# EAGLE design sliderController_V1.1 (EAGLE 7.3.0)
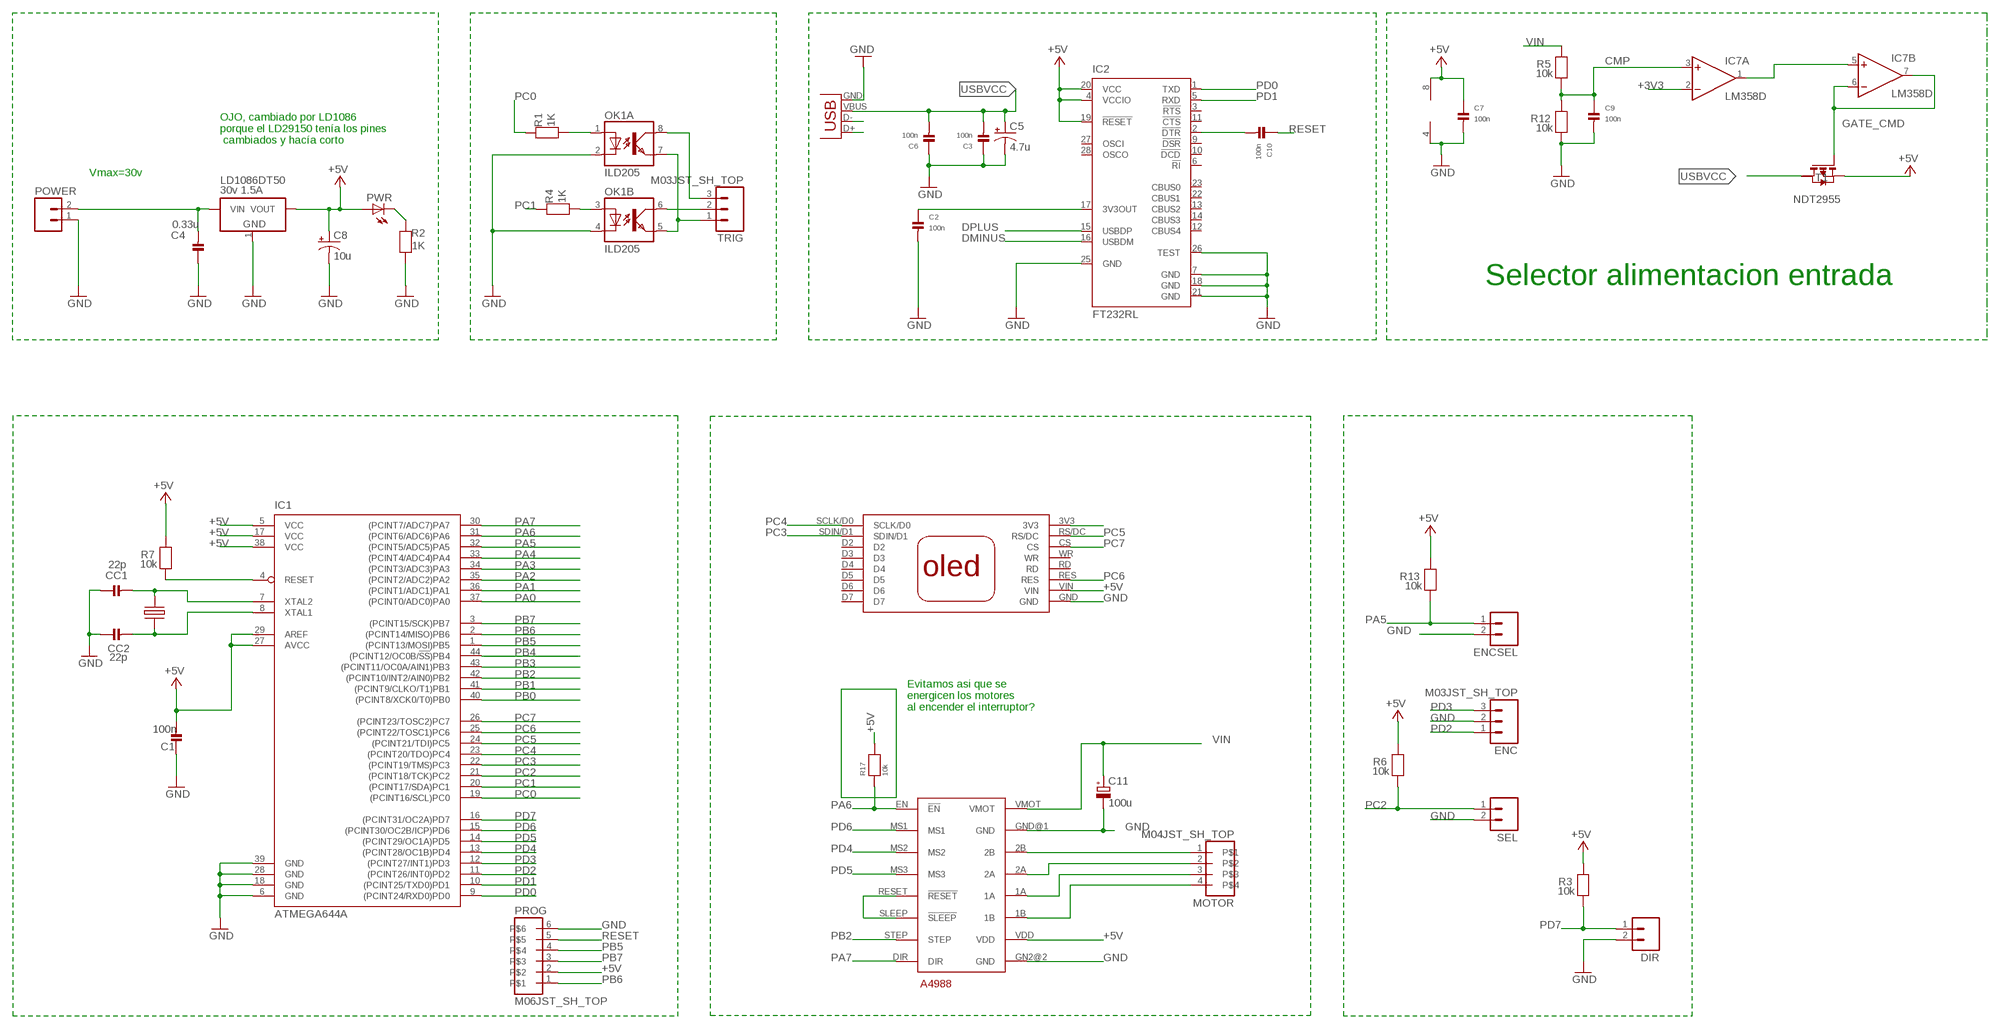
[diagram p0: schematic, sheet 1]

## Parts
A4988  STEPSTICK_A4988A4988  [STEPSTICK_A4988]
C1  100n  CAP_CERAMIC_0805  [_0805]
C2  100n  CAP_CERAMIC_0805  [_0805]
C3  100n  CAP_CERAMIC_0805  [_0805]
C4  0.33u  CAP_CERAMIC_0805  [_0805]
C5  4.7u  CAP_POL1206  [EIA3216]
C6  100n  CAP_CERAMIC_0805  [_0805]
C7  100n  CAP_CERAMIC0805  [0805]
C8  10u  CAP_POL1206  [EIA3216]
C9  100n  CAP_CERAMIC0805  [0805]
C10  100n  CAP_CERAMIC_0805  [_0805]
C11  100u  CPOL-EUD  [PANASONIC_D]
CC1  22p  CAP_CERAMIC_0805  [_0805]
CC2  22p  CAP_CERAMIC_0805  [_0805]
CRISTAL  CRISTALSMD  [CRISTAL5X3.2MM]
DIR  M02JST_SH_TOP  [JST_1.0_2_TOP]
ENC  M03JST_SH_TOP  [JST_1.0_3_TOP]
ENCSEL  M02JST_SH_TOP  [JST_1.0_2_TOP]
IC1  ATMEGA644A  [TQFP44]
IC2  FT232RL  [SSOP28]
IC7  LM358D  [SO08]
LD1086DT50  30v 1.5A  VREG_3PINS-DPAK  [DPAK]
MOTOR  M04JST_SH_TOP  [JST_1.0_4_TOP]
OK1  ILD205  [SOIC08]
POWER  M02JST_SH_TOP  [JST_1.0_2_TOP]
PROG  M06JST_SH_TOP  [JST_1.0_6_TOP]
PWR  LEDCHIP-LED0805  [CHIP-LED0805]
R1  1K  RESISTOR0805  [0805]
R2  1K  RESISTOR0805  [0805]
R3  10k  RESISTOR0805  [0805]
R4  1K  RESISTOR0805  [0805]
R5  10k  RESISTOR0805  [0805]
R6  10k  RESISTOR0805  [0805]
R7  10k  RESISTOR0805  [0805]
R12  10k  RESISTOR0805  [0805]
R13  10k  RESISTOR0805  [0805]
R17  10k  RESISTOR0805  [0805]
SEL  M02JST_SH_TOP  [JST_1.0_2_TOP]
T1  NDT2955  PMOSSOT223  [SOT223]
TRIG  M03JST_SH_TOP  [JST_1.0_3_TOP]
U$3  OLEDOLED1.3"  [OLED1.3"]
X2  USBSMD  [USB-MINIB]

## Nets
+3V3 [power]: C2.1 IC2.17(3V3OUT) IC7.2(A:-IN)
+5V: A4988.VDD C1.2 C7.1 C8.A(+) IC1.5(VCC) IC1.17(VCC) IC1.27(AVCC) IC1.29(AREF) IC1.38(VCC) IC2.4(VCCIO) IC2.19(!RESET) IC2.20(VCC) IC7.8(P:V+) LD1086DT50.2(VOUT) PROG.2 PWR.A R3.2 R6.2 R7.2 R13.2 R17.2 T1.3(S) U$3.VIN
CMP: C9.1 IC7.3(A:+IN) R5.1 R12.2
DMINUS: IC2.16(USBDM) X2.D-
DPLUS: IC2.15(USBDP) X2.D+
GATE_CMD: IC7.6(B:-IN) IC7.7(B:OUT) T1.1(G)
GND [gnd]: A4988.GN2@2(GND) A4988.GND@1(GND) C1.1 C2.2 C3.1 C4.1 C5.C(-) C6.1 C7.2 C8.C(-) C9.2 C11.- CC1.1 CC2.1 DIR.2 ENC.2 ENCSEL.2 IC1.6(GND) IC1.18(GND) IC1.28(GND) IC1.39(GND) IC2.7(GND) IC2.18(GND) IC2.21(GND) IC2.25(GND) IC2.26(TEST) IC7.4(P:V-) LD1086DT50.1(GND) OK1.2(A:C) OK1.4(B:C) POWER.1 PROG.6 R2.2 R12.1 SEL.2 U$3.GND X2.GND
N$1: C10.2 IC2.2(!DTR)
N$2: PWR.C R2.1
N$3: CC1.2 CRISTAL.B IC1.7(XTAL2)
N$4: A4988.RESET(!RESET) A4988.SLEEP(!SLEEP)
N$6: OK1.1(A:A) R1.2
N$7: OK1.8(A:COL) TRIG.3
N$9: OK1.6(B:COL) TRIG.2
N$10: OK1.5(B:EMIT) OK1.7(A:EMIT) TRIG.1
N$11 [usbvcc]: A4988.2B MOTOR.1
N$13: CC2.2 CRISTAL.A IC1.8(XTAL1)
N$14: OK1.3(B:A) R4.2
N$16 [usbvcc]: A4988.2A MOTOR.2
N$18 [usbvcc]: A4988.1A MOTOR.3
N$23 [usbvcc]: A4988.1B MOTOR.4
N$24: U$3.3V3
N$28: IC7.1(A:OUT) IC7.5(B:+IN)
PA0: IC1.37((PCINT0/ADC0)PA0)
PA1: IC1.36((PCINT1/ADC1)PA1)
PA2: IC1.35((PCINT2/ADC2)PA2)
PA3: IC1.34((PCINT3/ADC3)PA3)
PA4: IC1.33((PCINT4/ADC4)PA4)
PA5: ENCSEL.1 IC1.32((PCINT5/ADC5)PA5) R13.1
PA6: A4988.EN(!EN) IC1.31((PCINT6/ADC6)PA6) R17.1
PA7: A4988.DIR IC1.30((PCINT7/ADC7)PA7)
PB0: IC1.40((PCINT8/XCK0/T0)PB0)
PB1: IC1.41((PCINT9/CLKO/T1)PB1)
PB2: A4988.STEP IC1.42((PCINT10/INT2/AIN0)PB2)
PB3: IC1.43((PCINT11/OC0A/AIN1)PB3)
PB4: IC1.44((PCINT12/OC0B/!SS!)PB4)
PB5: IC1.1((PCINT13/MOSI)PB5) PROG.4
PB6: IC1.2((PCINT14/MISO)PB6) PROG.1
PB7: IC1.3((PCINT15/SCK)PB7) PROG.3
PC0: IC1.19((PCINT16/SCL)PC0) R1.1
PC1: IC1.20((PCINT17/SDA)PC1) R4.1
PC2: IC1.21((PCINT18/TCK)PC2) R6.1 SEL.1
PC3: IC1.22((PCINT19/TMS)PC3) U$3.SDIN/D1
PC4: IC1.23((PCINT20/TDO)PC4) U$3.SCLK/D0
PC5: IC1.24((PCINT21/TDI)PC5) U$3.RS/DC
PC6: IC1.25((PCINT22/TOSC1)PC6) U$3.RES
PC7: IC1.26((PCINT23/TOSC2)PC7) U$3.CS
PD0: IC1.9((PCINT24/RXD0)PD0) IC2.1(TXD)
PD1: IC1.10((PCINT25/TXD0)PD1) IC2.5(RXD)
PD2: ENC.1 IC1.11((PCINT26/INT0)PD2)
PD3: ENC.3 IC1.12((PCINT27/INT1)PD3)
PD4: A4988.MS2 IC1.13((PCINT28/OC1B)PD4)
PD5: A4988.MS3 IC1.14((PCINT29/OC1A)PD5)
PD6: A4988.MS1 IC1.15((PCINT30/OC2B/ICP)PD6)
PD7: DIR.1 IC1.16((PCINT31/OC2A)PD7) R3.1
RESET: C10.1 IC1.4(RESET) PROG.5 R7.1
USBVCC: C3.2 C5.A(+) C6.2 T1.2(D) X2.VBUS
VIN [power]: A4988.VMOT C4.2 C11.+ LD1086DT50.3(VIN) POWER.2 R5.2
Unconnected: IC2.3(!RTS) IC2.6(!RI) IC2.9(!DSR) IC2.10(!DCD) IC2.11(!CTS) IC2.12(CBUS4) IC2.13(CBUS2) IC2.14(CBUS3) IC2.22(CBUS1) IC2.23(CBUS0) IC2.27(OSCI) IC2.28(OSCO) T1.4(D2) U$3.D2 U$3.D3 U$3.D4 U$3.D5 U$3.D6 U$3.D7 U$3.RD U$3.WR

## Notes on the sheet
- OJO, cambiado por LD1086 
  porque el LD29150 tenía los pines
   cambiados y hacía corto
- Vmax=30v
- Selector alimentacion entrada
- Evitamos asi que se 
  energicen los motores 
  al encender el interruptor?

## Library data of the parts
A4988 = javimontero:STEPSTICK_A4988: Pololu A4988 stepstick stepper driver
C1-C4 C6 C7 C9 C10 CC1 CC2 = microbuilder:CAP_CERAMIC: Ceramic Capacitors 0402 - 0402 Surface Mount Capacitors 16pF 50V 5% [Digikey: 445-4899-2-ND] 18pF 50V 5% [Digikey: 490-1281-2-ND] 22pF 50V 5% [Digikey: 490-1283-2-ND] 68pF 50V 5% [Digikey: 490-1289-2-ND] 0.1uF 10V 10% [Digikey: 490-1318-2-ND] 1.0uF 6.3V 10% [Digikey: 490-1320-2-ND] 0603 - 0603 Surface Mount Capacitors 16 pF 50V 5% [Digikey: 445-5051-2-ND] 22 pF 50V [Digikey: PCC220ACVTR-ND] 33 pF 50V 5% [Digikey: 490-1415-1-ND] 56pF 50V 5% [Digikey: 490-1421-1-ND] 220pF 50V 5% [Digikey: 445-1285-1-ND] 680 pF 50V 2200 pF 50V 5% C0G [Digikey: 445-1297-1-ND] 5600 pF 100V 5% X7R [Digikey: 478-3711-1-ND] 0.1 µF 25V 10% [Digikey: PCC2277TR-ND] 0.22 µF 16V 10% X7R [Digikey: 445-1318-1-ND] 1.0 µF 25V 10% [Digikey: 445-5146-2-ND] 0603 - RF Specific 3pF 250V +/-0.1pF RF [Digikey: 712-1347-1-ND] 18 pF 250V 5% [Digikey: 478-3505-1-ND or 712-1322-1-ND] 56 pF 250V 5% C0G RF [Digikey: 490-4867-1-ND] 68 pF 250V RF [Digikey: 490-4868-1-ND] 0805 - 0805 Surface Mount Capacitors 220 pF 250V 2% RF Ceramic Capacitor [Digikey: 712-1398-1-ND] 1000 pF 50V 2% NP0 Ceramic Capacitor [Digikey: 478-3760-1-ND] 0.1 µF 25V 10% Ceramic Capacitor [Digikey: PCC1828TR-ND] 1.0 µF 16V 10% Ceramic Capacitor[Digikey: 490-1691-2-ND] 10.0 µF 10V 10% Ceramic Capacitor[Digikey: 709-1228-1-ND] 10.0 uF 16V 10% Ceramic Capacitor [Digikey: 478-5165-2-ND] 47 uF 6.3V 20% Ceramic Capacitor [Digikey: 587-1779-1-ND or 399-5506-1-ND] 1206 - 1206 Surface Mount Capacitors 47uF 10V 20% Ceramic Capacitor [Digikey: 490-5528-1-ND or 399-5508-1-ND or 445-6010-1-ND] 100uF 6.3V -20%, +80% Y5V Ceramic Capacitor (Digikey: 490-4512-1-ND, Mouser: 81-GRM31CF50J107ZE1L)
C5 C8 = SparkFun-Passives:CAP_POL: Capacitor Polarized These are standard SMD and PTH capacitors. Normally 10uF, 47uF, and 100uF in electrolytic and tantalum varieties. Always verify the external diameter of the through hole cap, it varies with capacity, voltage, and manufacturer. The EIA devices should be standard.
C11 = matt rcl:CPOL-EU: POLARIZED CAPACITOR, European symbol
CRISTAL = javimontero:CRISTALSMD
DIR ENCSEL POWER SEL = javimontero:M02: Terminal block Contacts: 2 PITCH2.54: 2.54mm pitch Mouser: 571-282834-2 <http://es.mouser.com/Search/ProductDetail.aspx?R=282834-2virtualkey57110000virtualkey571-282834-2> PITCH5.00: 5mm pitch
ENC TRIG = javimontero:M03
IC1 = atmel:ATMEGA644: 8-bit Microcontroller with 64K Bytes In-System Programmable Flash Source: http://www.atmel.com/dyn/resources/prod_documents/doc2593.pdf; MPN: ATMEGA644PV-10AU; OC_FARNELL: 1455123; OC_NEWARK: 58M3748
IC2 = ftdichip:FT232R: Source: http://www.ftdichip.com/Documents/DataSheets/DS_FT232R_v104.pdf; MPN: FT232RL; OC_FARNELL: 1146032; OC_NEWARK: 91K9918
IC7 = linear:LM358: OP AMP also LM158; LM258; LM2904 Source: http://cache.national.com/ds/LM/LM158.pdf
LD1086DT50 = dp_devices:VREG_3PINS: Various 3 pin voltage regulators in different packages Double check the right pinout for the right part
MOTOR = javimontero:M04
OK1 = optocoupler:ILD2*: Siemens ILD205/206/207/211/213/217 DUAL PHOTOTRANSISTOR SMALL OUTLINE SURFACE MOUNT OPTOCOUPLER Source: 153385-da-01-en-Optocoupler_ILD205-T.pdf; MF: VISHAY/TELEFUNKEN; MPN: ILD205T; OC_FARNELL: 1469512; OC_NEWARK: 20H8678
PROG = javimontero:M06
PWR = led:LED: LED OSRAM: - CHIPLED LG R971, LG N971, LY N971, LG Q971, LY Q971, LO R971, LY R971 LH N974, LH R974 LS Q976, LO Q976, LY Q976 LO Q996 - Hyper CHIPLED LW Q18S LB Q993, LB Q99A, LB R99A - SideLED LS A670, LO A670, LY A670, LG A670, LP A670 LB A673, LV A673, LT A673, LW A673 LH A674 LY A675 LS A676, LA A676, LO A676, LY A676, LW A676 LS A679, LY A679, LG A679 - Hyper Micro SIDELED® LS Y876, LA Y876, LO Y876, LY Y876 LT Y87S - SmartLED LW L88C, LW L88S LB L89C, LB L89S, LG L890 LS L89K, LO L89K, LY L89K LS L896, LA L896, LO L896, LY L896 - TOPLED LS T670, LO T670, LY T670, LG T670, LP T670 LSG T670, LSP T670, LSY T670, LOP T670, LYG T670 LG T671, LOG T671, LSG T671 LB T673, LV T673, LT T673, LW T673 LH T674 LS T676, LA T676, LO T676, LY T676, LB T676, LH T676, LSB T676, LW T676 LB T67C, LV T67C, LT T67C, LS T67K, LO T67K, LY T67K, LW E67C LS E67B, LA E67B, LO E67B, LY E67B, LB E67C, LV E67C, LT E67C LW T67C LS T679, LY T679, LG T679 LS T770, LO T770, LY T770, LG T770, LP T770 LB T773, LV T773, LT T773, LW T773 LH T774 LS E675, LA E675, LY E675, LS T675 LS T776, LA T776, LO T776, LY T776, LB T776 LHGB T686 LT T68C, LB T68C - Hyper Mini TOPLED® LB M676 - Mini TOPLED Santana® LG M470 LS M47K, LO M47K, LY M47K Source: http://www.osram.convergy.de LUXEON: - LUMILED® LXK2-PW12-R00, LXK2-PW12-S00, LXK2-PW14-U00, LXK2-PW14-V00 LXK2-PM12-R00, LXK2-PM12-S00, LXK2-PM14-U00 LXK2-PE12-Q00, LXK2-PE12-R00, LXK2-PE12-S00, LXK2-PE14-T00, LXK2-PE14-U00 LXK2-PB12-K00, LXK2-PB12-L00, LXK2-PB12-M00, LXK2-PB14-N00, LXK2-PB14-P00, LXK2-PB14-Q00 LXK2-PR12-L00, LXK2-PR12-M00, LXK2-PR14-Q00, LXK2-PR14-R00 LXK2-PD12-Q00, LXK2-PD12-R00, LXK2-PD12-S00 LXK2-PH12-R00, LXK2-PH12-S00 LXK2-PL12-P00, LXK2-PL12-Q00, LXK2-PL12-R00 Source: www.luxeon.com KINGBRIGHT: KA-3528ASYC Source: www.kingbright.com
R1-R7 R12 R13 R17 = microbuilder:RESISTOR: Resistors 0402 - 0402 Surface Mount Package 22 Ohm 1% 1/16W [Digikey: 311-22.0LRTR-ND] 33 Ohm 5% 1/16W 1.0K 5% 1/16W 1.5K 5% 1/16W 2.0K 1% 1/16W 10.0K 1% 1/16W [Digikey: 311-10.0KLRTR-ND] 10.0K 5% 1/16W [Digikey: RMCF0402JT10K0TR-ND] 12.1K 1% 1/16W [Digikey: 311-22.0LRTR-ND] 100.0K 5% 1/16W 0603 - 0603 Surface Mount Package 0 Ohm 1/10 Watt 1% Resistor 15 Ohm 1/10 Watt 1% Resistor 33 Ohm 1/10 Watt 1% Resistor 49.9 Ohm 1/10 Watt 1% Resistor 100 Ohm 1/10 Watt 1% Resistor 150 Ohm 1/10 Watt 1% Resistor 240 Ohm 1/10 Watt 1% Resistor 390 Ohm 1/10 Watt 1% Resistor 560 Ohm 1/10 Watt 1% Resistor 680 Ohm 1/10 Watt 1% Resistor 750 Ohm 1/10 Watt 1% Resistor 1.0K Ohm 1/10 Watt 1% Resistor 1.5K Ohm 1/10 Watt 1% Resistor 2.0K Ohm 1/10 Watt 1% Resistor 2.2K Ohm 1/10 Watt 1% Resistor 3.3K Ohm 1/10 Watt 1% Resistor 4.7K Ohm 1/10 Watt 1% Resistor 10.0K Ohm 1/10 Watt 1% Resistor 12.0K Ohm 1/10 Watt 1% Resistor 12.1K Ohm 1/10 Watt 1% Resistor 20.0K Ohm 1/10 Watt 1% Resistor 33.0K Ohm 1/10 Watt 1% Resistor 100.0K Ohm 1/10 Watt 1% Resistor 0805 - 0805 Surface Mount Package 0 Ohm 1/8 Watt 1% Resistor 33 Ohm 1/8 Watt 1% Resistor 100 Ohm 1/8 Watt 1% Resistor 150 Ohm 1/8 Watt 1% Resistor 200 Ohm 1/8 Watt 1% Resistor 240 Ohm 1/8 Watt 1% Resistor 330 Ohm 1/8 Watt 1% Resistor 390 Ohm 1/8 Watt 1% Resistor 470 Ohm 1/8 Watt 1% Resistor 1.0K Ohm 1/8 Watt 1% Resistor 1.5K Ohm 1/8 Watt 1% Resistor 2.0K Ohm 1/8 Watt 1% Resistor 4.7K Ohm 1/8 Watt 1% Resistor 5.1K Ohm 1/8 Watt 1% Resistor 5.6K Ohm 1/8 Watt 1% Resistor 10.0K Ohm 1/8 Watt 1% Resistor 22.0K Ohm 1/8 Watt 1% Resistor 33.0K Ohm 1/8 Watt 1% Resistor 100K Ohm 1/8 Watt 1% Resistor 1206 - 1206 Surface Mount Package 2012 - 2010 Surface Mount Package 0.11 Ohm 1/2 Watt 1% Resistor - Digikey: RHM.11UCT-ND
T1 = zetex:PMOSSOT223: MOS FET
U$3 = javimontero:OLED: Display OLED
X2 = SparkFun-Connectors:USB: USB Connectors USB-B-PTH is fully proven SKU : PRT-00139 USB-miniB is fully proven SKU : PRT-00587 USB-A-PCB is untested. USB-A-H is throughly reviewed, but untested. Spark Fun Electronics SKU : PRT-00437 USB-B-SMT is throughly reviewed, but untested. Needs silkscreen touching up. USB-A-S has not been used/tested USB-MB-H has not been used/tested

## Net classes
0 default: width 0.203 mm, drill 0.305 mm, clearance 0.203 mm
1 power: width 0.406 mm, drill 0.711 mm, clearance 0.203 mm
2 gnd: width 0.203 mm, drill 0.305 mm, clearance 0.203 mm
3 usbvcc: width 0.203 mm, drill 0.305 mm, clearance 0.203 mm
4 power5: width 0.203 mm, drill 0.305 mm, clearance 0.203 mm

## Board
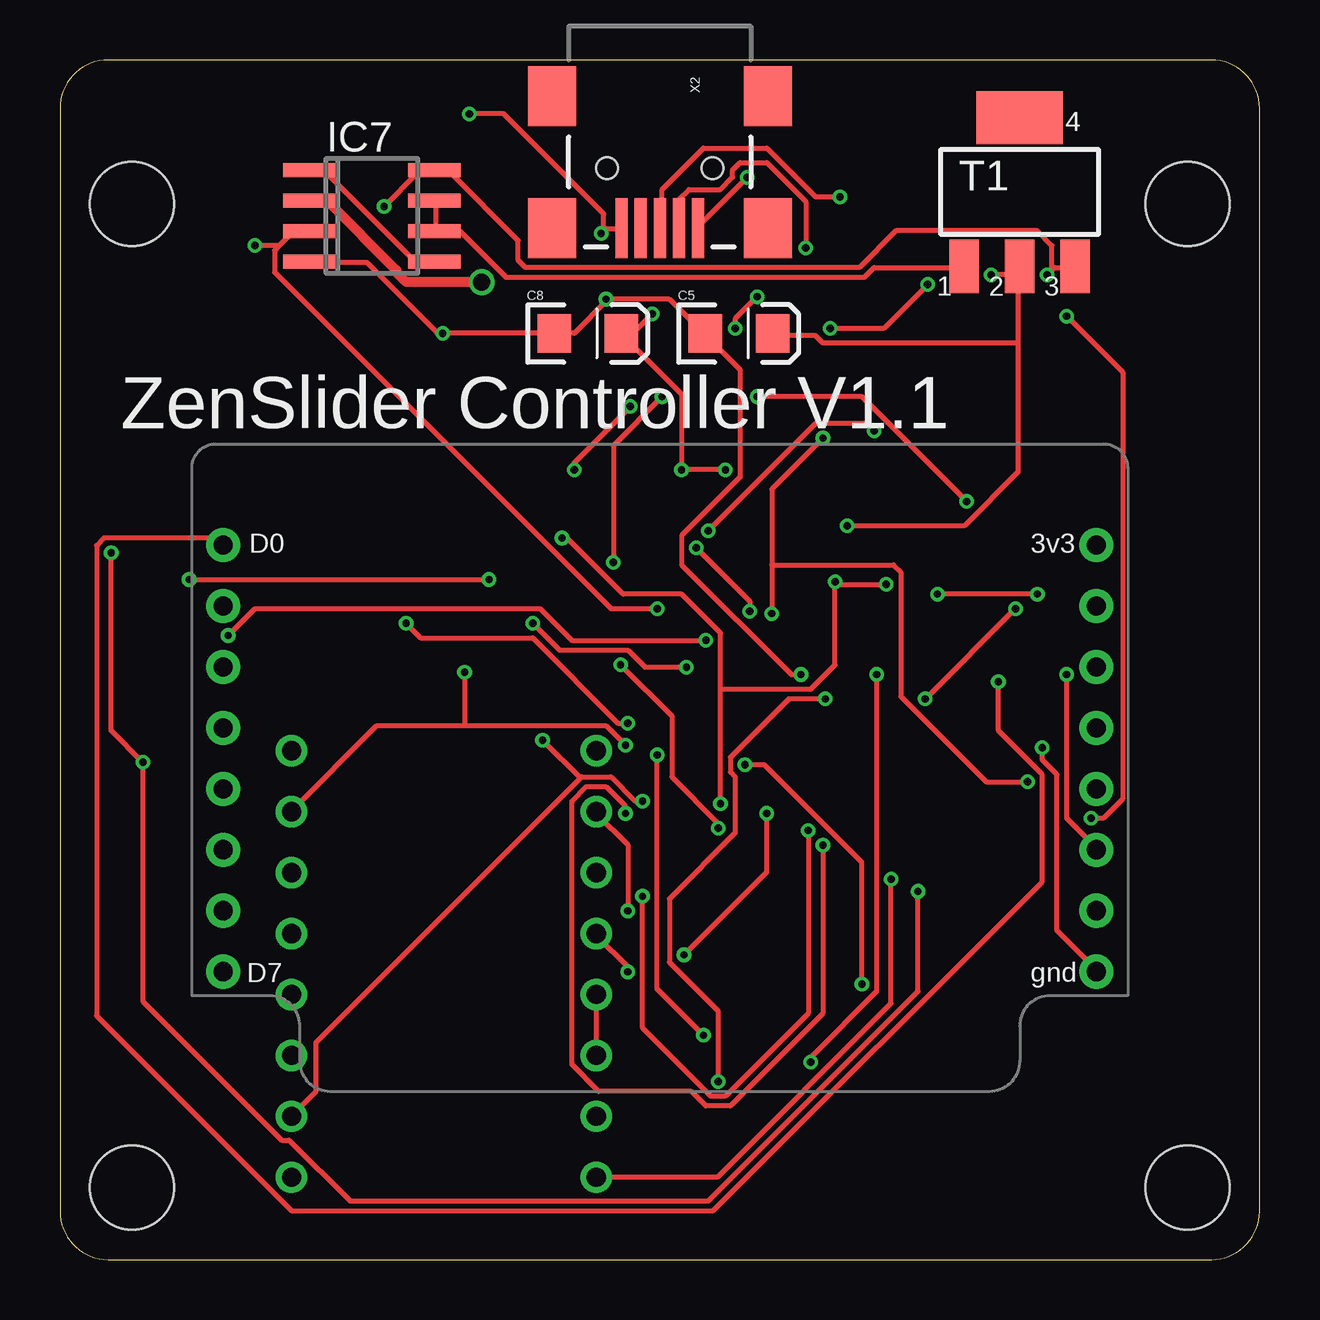
[diagram p1: board, top side]
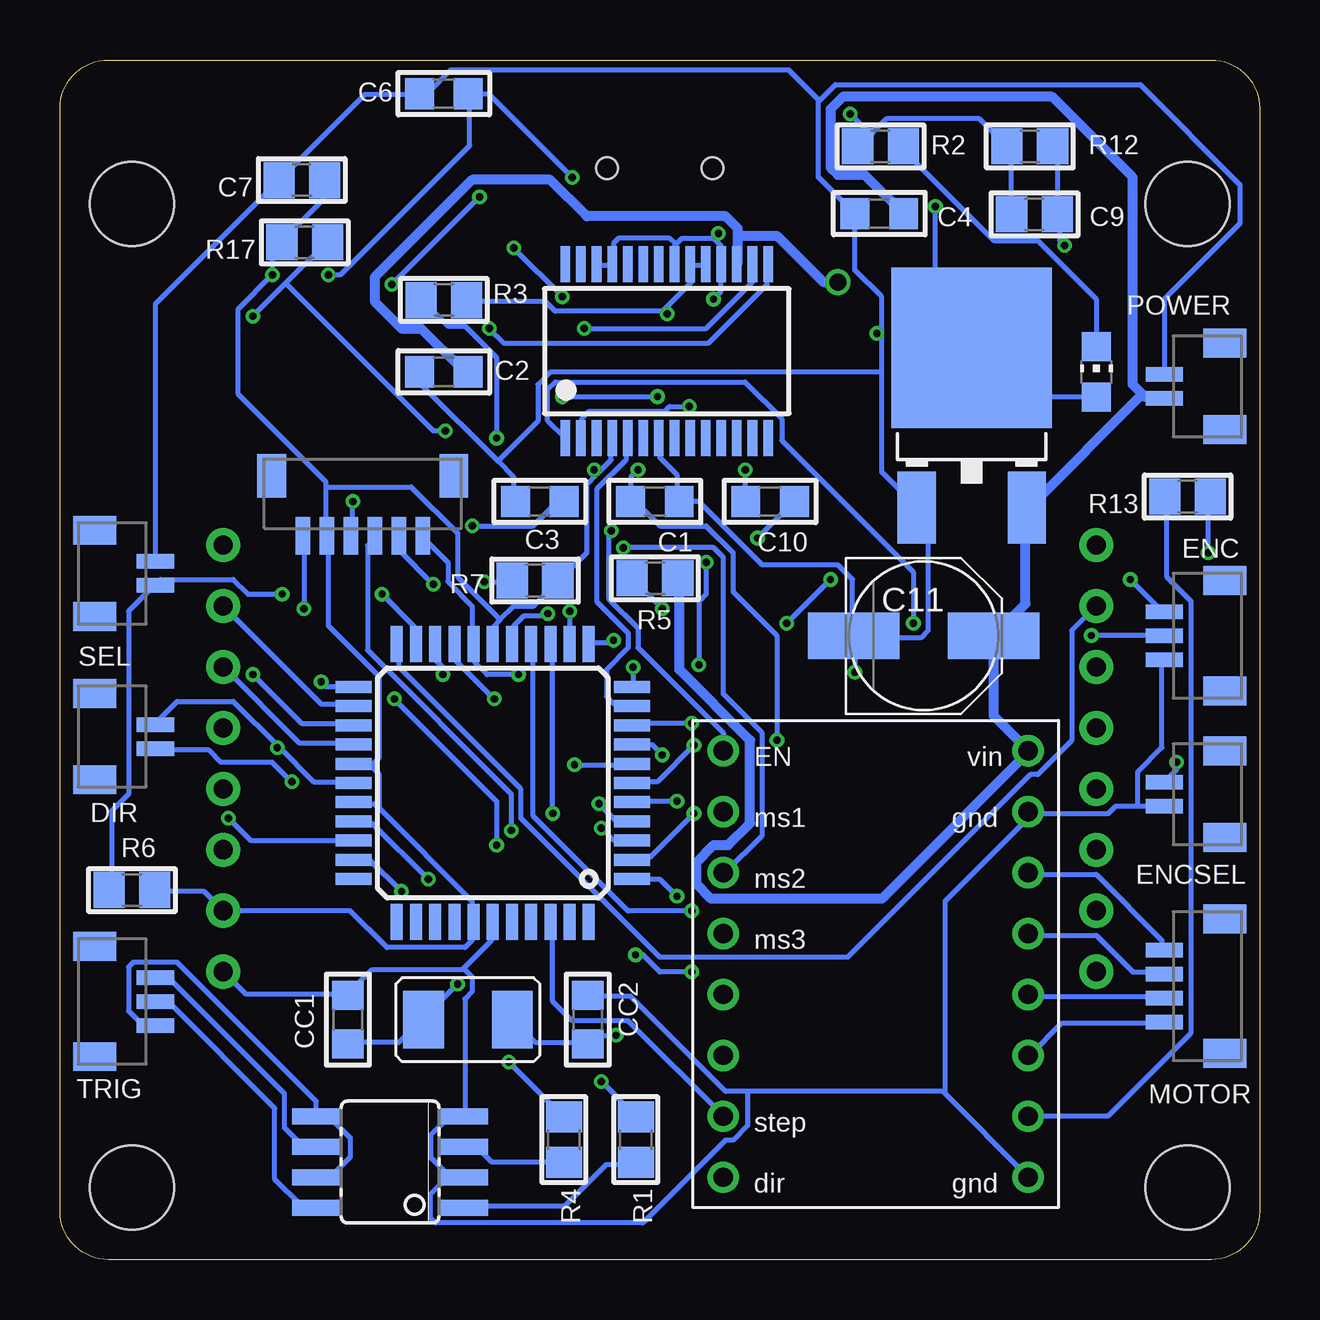
[diagram p2: board, bottom side, seen from below]

Size 50 x 50 mm. Coordinates in mm from the lower left corner, seen from the top.
Outline: 2,0 48,0 arc90 50,2 50,48 arc90 48,50 2,50 arc90 0,48 0,2 arc90 2,0
Copper layers (1*16): Top 0.035mm / dielectric 1.5mm / Bottom 0.035mm
Design rules "Elecrow_2-layer_eagle_rule": minimum track width 6mil, minimum drill 12mil, track to track 6mil, track to pad 6mil, pad to pad 6mil, via to via 6mil, smd to smd 0mil, copper to edge 10mil, drill to drill 10mil, minimum pad ring 10mil, minimum via ring 6mil, stop-mask expansion 2mil, vias tented up to drill 100mil, thermal gap 10mil
Holes 3.5 mm at 47,44 47,3 3,3 3,44

### Footprints (pad centres in the part's own frame; a part is rotated, then mirrored left to right if it is on the bottom)
STEPSTICK_A4988 = drill 0.8: 1A 6.35,-1.27; 1B 6.35,-3.81; 2A 6.35,1.27; 2B 6.35,3.81; DIR -6.35,-8.89; EN -6.35,8.89; GN2@2 6.35,-8.89; GND@1 6.35,6.35; MS1 -6.35,6.35; MS2 -6.35,3.81; MS3 -6.35,1.27; RESET -6.35,-1.27; SLEEP -6.35,-3.81; STEP -6.35,-6.35; VDD 6.35,-6.35; VMOT 6.35,8.89
_0805 = smd 1.2 x 1.3: 1 -1.016,0; 2 1.016,0
EIA3216 = smd 1.4 x 1.6: A 1.4,0; C -1.4,0
0805 = smd 1.3 x 1.5: 1 -0.95,0; 2 0.95,0
PANASONIC_D = smd 3.81 x 1.93: + 2.908,0; - -2.908,0
CRISTAL5X3.2MM = smd 1.7 x 2.4: A -1.85,0; B 1.85,0
JST_1.0_2_TOP = smd 0.6 x 1.55: 1 -0.5,0.025; 2 0.5,0.025 | smd 1.2 x 1.8: P$3 -1.8,2.55; P$4 1.8,2.55
JST_1.0_3_TOP = smd 0.6 x 1.55: 1 -1,0.025; 2 1,0.025; 3 0,0.025 | smd 1.2 x 1.8: P$3 -2.3,2.55; P$4 2.3,2.55
TQFP44 = smd 1.5 x 0.5: 1 -5.8,4; 2 -5.8,3.2; 3 -5.8,2.4; 4 -5.8,1.6; 5 -5.8,0.8; 6 -5.8,0; 7 -5.8,-0.8; 8 -5.8,-1.6; 9 -5.8,-2.4; 10 -5.8,-3.2; 11 -5.8,-4; 23 5.8,-4; 24 5.8,-3.2; 25 5.8,-2.4; 26 5.8,-1.6; 27 5.8,-0.8; 28 5.8,0; 29 5.8,0.8; 30 5.8,1.6; 31 5.8,2.4; 32 5.8,3.2; 33 5.8,4 | smd 0.5 x 1.5: 12 -4,-5.8; 13 -3.2,-5.8; 14 -2.4,-5.8; 15 -1.6,-5.8; 16 -0.8,-5.8; 17 0,-5.8; 18 0.8,-5.8; 19 1.6,-5.8; 20 2.4,-5.8; 21 3.2,-5.8; 22 4,-5.8; 34 4,5.8; 35 3.2,5.8; 36 2.4,5.8; 37 1.6,5.8; 38 0.8,5.8; 39 0,5.8; 40 -0.8,5.8; 41 -1.6,5.8; 42 -2.4,5.8; 43 -3.2,5.8; 44 -4,5.8
SSOP28 = smd 0.4 x 1.5: 1 -4.225,-3.625; 2 -3.575,-3.625; 3 -2.925,-3.625; 4 -2.275,-3.625; 5 -1.625,-3.625; 6 -0.975,-3.625; 7 -0.325,-3.625; 8 0.325,-3.625; 9 0.975,-3.625; 10 1.625,-3.625; 11 2.275,-3.625; 12 2.925,-3.625; 13 3.575,-3.625; 14 4.225,-3.625; 15 4.225,3.625; 16 3.575,3.625; 17 2.925,3.625; 18 2.275,3.625; 19 1.625,3.625; 20 0.975,3.625; 21 0.325,3.625; 22 -0.325,3.625; 23 -0.975,3.625; 24 -1.625,3.625; 25 -2.275,3.625; 26 -2.925,3.625; 27 -3.575,3.625; 28 -4.225,3.625
SO08 = smd 0.6 x 2.2: 1 -1.905,-2.6; 2 -0.635,-2.6; 3 0.635,-2.6; 4 1.905,-2.6; 5 1.905,2.6; 6 0.635,2.6; 7 -0.635,2.6; 8 -1.905,2.6
DPAK = smd 1.6 x 3: 1 -2.3,-6.65; 3 2.3,-6.65 | smd 6.7 x 6.7: 2 0,0
JST_1.0_4_TOP = smd 0.6 x 1.55: 1 -1.5,0.025; 2 -0.5,0.025; 3 0.5,0.025; 4 1.5,0.025 | smd 1.2 x 1.8: P$3 -2.8,2.55; P$4 2.8,2.55
SOIC08 = smd 0.66 x 2.032: 1 -1.905,-3.073; 2 -0.635,-3.073; 3 0.635,-3.073; 4 1.905,-3.073; 5 1.905,3.073; 6 0.635,3.073; 7 -0.635,3.073; 8 -1.905,3.073
JST_1.0_6_TOP = smd 0.6 x 1.55: 1 -2.5,-0.8; 2 -1.5,-0.8; 3 -0.5,-0.8; 4 0.5,-0.8; 5 1.5,-0.8; 6 2.5,-0.8 | smd 1.2 x 1.8: P$7 -3.8,1.7; P$8 3.8,1.7
CHIP-LED0805 = smd 1.2 x 1.2: A 0,-1.05; C 0,1.05
SOT223 = smd 1.219 x 2.235: 1 -2.311,-3.099; 2 0,-3.099; 3 2.311,-3.099 | smd 3.6 x 2.2: 4 0,3.099
OLED1.3" = drill 0.8 pad 1.422: 3V3 18.2,17.78; CS 18.2,12.7; D2 -18.2,12.7; D3 -18.2,10.16; D4 -18.2,7.62; D5 -18.2,5.08; D6 -18.2,2.54; D7 -18.2,0; GND 18.2,0; RD 18.2,7.62; RES 18.2,5.08; RS/DC 18.2,15.24; SCLK/D0 -18.2,17.78; SDIN/D1 -18.2,15.24; VIN 18.2,2.54; WR 18.2,10.16
USB-MINIB = smd 2.5 x 0.5: D+ 2.5,0; D- 2.5,0.8; GND 2.5,-1.6; ID 2.5,-0.8; VBUS 2.5,1.6 | smd 2.5 x 2: MTN1 -3,4.5; MTN2 2.5,4.5; MTN3 -3,-4.5; MTN4 2.5,-4.5 | hole 0.9: 0,2.2; 0,-2.2

### Placement (x,y rotation side)
A4988  16,12.32 0 bottom
C1  25.2,31.6 180 bottom
C2  34,37 180 bottom
C3  30,31.6 0 bottom
C4  15.85,43.6 0 bottom
C5  28.3,38.6 0 top
C6  34,48.6 0 bottom
C7  39.92,45 180 bottom
C8  22,38.6 0 top
C9  9.38,43.57 180 bottom
C10  20.4,31.6 180 bottom
C11  14,26 0 bottom
CC1  38,10 270 bottom
CC2  28,10 270 bottom
CRISTAL  33,10 180 bottom
DIR  46,21.8 90 bottom
ENC  4,26 270 bottom
ENCSEL  4,19.4 270 bottom
IC1  31.96,19.86 180 bottom
IC2  24.71,37.86 0 bottom
IC7  13,43.5 270 top
LD1086DT50  12,38 0 bottom
MOTOR  4,11.4 270 bottom
OK1  36.24,4.07 90 bottom
POWER  4,36.4 270 bottom
PROG  37.38,30.97 0 bottom
PWR  6.8,37 0 bottom
R1  26,5 270 bottom
R2  15.8,46.4 180 bottom
R3  34,40 0 bottom
R4  29,5 270 bottom
R5  25.2,28.4 0 bottom
R6  47,15.4 0 bottom
R7  30.2,28.3 0 bottom
R12  9.58,46.4 0 bottom
R13  3,31.8 180 bottom
R17  39.8,42.4 180 bottom
SEL  46,28.6 90 bottom
T1  40,44.5 0 top
TRIG  46,10.76 90 bottom
U$3  25,12 0 top
X2  25,45.5 270 top

### Tracks (layer width: path | path; a pad name or v marks a point on that pad's centre or on a via)
+3V3  (via drill 0.71)
  Top 0.406: v17.58,40.74 14.43,40.74 14.02,41.15 14.02,41.25 11.18,44.09 10.46,44.09 IC7.2
  Bottom 0.406: 21.74,42.67 21.74,41.55 IC2.17 | 21.74,42.67 21.74,42.98 22.25,43.48 28.04,43.48 29.57,45.01 32.82,45.01 36.88,40.95 36.88,39.93 35.76,38.81 34.95,38.81 33.22,37.08 33.02,37.08 C2.1 | v17.58,40.74 18.19,40.74 20.12,42.67 21.74,42.67
+5V  (via drill 0.3)
  Top 0.203: v24.28,19.1 23.98,19.1 22.96,20.12 21.74,20.12 21.69,20.07 | 21.69,20.07 10.67,9.04 10.67,7.01 9.65,5.99 A4988.VDD | v13.51,43.89 14.94,45.31 15.54,45.31 IC7.8 15.65,45.31 16.26,45.31 19.1,42.47 19.1,41.66 19.41,41.35 33.33,41.35 34.85,42.88 40.74,42.88 41.35,42.27 41.35,41.35 41.4,41.3 | v24.69,39.42 23.67,38.41 C8.A 23.47,38.51 25.91,36.07 v25.91,32.92 v27.74,32.92 | v41.15,41.05 41.4,41.3 | 41.4,41.3 41.45,41.35 42.27,41.35 T1.3 | v20.12,21.64 21.69,20.07
  Bottom 0.203: v24.28,19.1 26.11,19.1 IC1.5 | R13.2 3.86,31.7 3.86,28.45 2.85,27.43 2.85,9.45 6.3,5.99 9.55,5.99 A4988.VDD | PWR.A 6.81,35.97 9.96,35.97 LD1086DT50.2 12.09,38.1 13.51,39.52 v13.51,43.89 | v25.91,32.92 26.21,32.61 26.21,31.7 C1.2 26.11,31.7 24.99,30.58 23.06,30.58 21.95,29.46 21.95,27.84 20.12,26.01 v20.12,21.64 | IC2.19 23.16,41.45 23.67,41.45 IC2.20 23.67,41.35 23.67,40.74 24.84,39.57 | 24.84,39.57 24.89,39.52 29.36,39.52 29.77,39.93 33.02,39.93 R3.2 | 24.84,39.57 v24.69,39.42 | 31.65,26.67 31.09,27.23 30.28,27.23 29.26,28.25 R7.2 29.16,28.35 28.04,29.46 28.04,32.31 27.58,32.77 | 31.65,26.67 31.9,26.42 31.9,25.7 IC1.17 | 27.58,32.77 27.03,33.33 27.03,34.14 IC2.4 | C7.1 39.01,44.91 39.01,44.2 40.74,42.47 R17.2 40.84,42.37 41.15,42.06 v41.15,41.05 42.57,39.62 42.57,36.07 38.91,32.41 38.91,32.21 | R6.2 46.02,15.34 43.99,15.34 43.28,14.63 U$3.VIN 43.18,14.53 37.9,14.53 36.37,13.01 33.12,13.01 32.82,13.31 32.82,14.02 IC1.38 32.82,14.12 32.82,14.94 36.73,18.85 | 36.73,18.85 36.88,19 37.69,19 IC1.29 | 37.03,20.57 36.68,20.22 36.68,18.9 36.73,18.85 | 37.03,20.57 37.08,20.62 37.69,20.62 IC1.27 | 37.03,20.57 36.68,20.93 36.68,24.28 38.81,26.42 38.81,30.07 PROG.2 38.91,30.18 38.91,32.21 | 31.65,26.67 33.43,28.45 33.43,30.28 35.36,32.21 38.91,32.21 | 27.58,32.77 v27.74,32.92
CMP  (via drill 0.3)
  Top 0.203: v24.89,27.13 22.96,27.13 8.94,41.15 8.94,42.06 9.09,42.22 | 9.09,42.22 9.65,42.77 10.36,42.77 IC7.3 | v8.13,42.27 9.04,42.27 9.09,42.22
  Bottom 0.203: R12.2 8.53,46.33 8.43,46.23 8.43,43.59 C9.1 8.33,43.48 8.33,42.47 v8.13,42.27 | v24.89,27.13 26.11,28.35 R5.1
DMINUS  (via drill 0.3)
  Top 0.203: v28.14,38.81 28.14,39.22 v29.06,40.13 | v31.09,42.16 31.09,44.09 29.46,45.72 28.35,45.72 28.04,45.41 28.04,45.11 27.53,44.6 26.21,44.6 25.81,44.2 25.81,43.08 X2.D-
  Bottom 0.203: v28.14,38.81 23.06,38.81 21.13,40.74 21.13,41.45 IC2.16 | v31.09,42.16 v29.06,40.13
DPLUS  (via drill 0.3)
  Top 0.203: v32.11,38.81 34.34,38.81 v36.17,40.64 | v32.51,44.3 31.5,44.3 29.46,46.33 26.82,46.33 25.09,44.6 25.09,43.08 X2.D+
  Bottom 0.203: v32.11,38.81 31.5,38.2 22.96,38.2 20.52,40.64 20.52,41.45 IC2.15 | v32.51,44.3 v36.17,40.64
GATE_CMD
  Top 0.203: IC7.7 15.65,44.09 15.65,42.88 IC7.6 15.75,42.88 16.66,42.88 18.59,40.95 33.53,40.95 33.93,41.35 37.59,41.35 T1.1
GND  (via drill 0.3)
  Top 0.203: v40.95,21.34 40.95,20.83 41.55,20.22 41.55,13.72 43.18,12.09 U$3.GND | v23.57,21.44 22.76,22.25 16.87,22.25 | 16.87,22.25 13.21,22.25 9.65,18.69 A4988.GND@1 | X2.GND 23.37,42.98 22.76,42.98 v22.55,42.77 22.66,42.98 22.66,43.59 18.49,47.75 v17.07,47.75 | 22.81,39.98 22.86,40.03 25.4,40.03 26.82,38.61 C5.C 26.92,38.51 28.35,37.08 28.35,32.61 25.91,30.18 25.91,28.96 30.48,24.38 v30.89,24.38 | 22.81,39.98 21.44,38.61 20.62,38.61 C8.C 20.52,38.61 v15.95,38.61 15.75,38.61 12.8,41.55 10.46,41.55 IC7.4 | v22.76,40.03 22.81,39.98 | v16.87,24.49 16.87,22.25
  Bottom 0.203: 40.89,21.39 42.77,23.27 45.11,23.27 46.02,22.35 DIR.2 | 40.89,21.39 39.42,19.91 37.8,19.91 IC1.28 | U$3.GND 43.18,11.99 42.27,11.07 38.1,11.07 CC1.1 38,11.07 36.98,12.09 33.22,12.09 33.17,12.14 | 33.17,12.14 32,13.31 32,14.02 IC1.39 | 33.17,12.14 32.82,11.79 32.82,11.18 33.12,10.87 33.12,5.99 OK1.4 33.22,5.89 33.83,5.89 34.54,5.18 34.54,4.27 33.73,3.45 33.22,3.45 OK1.2 33.83,3.45 34.54,2.74 34.54,1.73 34.34,1.52 25.7,1.52 22.25,4.98 21.95,4.98 21.34,5.59 21.34,7.01 | v40.95,21.34 40.89,21.39 | 21.34,7.01 13.21,7.01 13.16,6.96 | 21.34,7.01 22.25,7.01 26.21,10.97 27.94,10.97 CC2.1 | 13.16,6.96 9.65,3.45 A4988.GN2@2 | v23.57,21.44 25.09,19.91 26.11,19.91 IC1.6 | 5.08,18.9 5.99,18.9 6.3,18.59 9.55,18.59 A4988.GND@1 9.55,18.49 13.11,14.94 13.11,7.01 13.16,6.96 | 5.08,18.9 4.06,18.9 ENCSEL.2 | 5.08,18.9 5.08,20.32 4.06,21.34 4.06,24.99 ENC.2 | C9.2 10.36,43.59 10.36,46.23 10.46,46.33 R12.1 10.57,46.43 11.68,47.55 15.54,47.55 16.66,46.43 R2.2 16.26,46.94 v17.07,47.75 | 27.03,41.45 IC2.25 | IC2.25 27.13,41.45 27.64,41.45 IC2.26 | 22.45,41.45 IC2.18 | 22.76,42.57 22.45,42.27 22.45,41.55 IC2.18 | 22.76,42.57 24.08,42.57 24.33,42.32 | 24.33,42.32 24.38,42.27 24.38,41.55 IC2.21 24.38,41.45 | 24.33,42.32 24.59,42.57 26.72,42.57 26.92,42.37 26.92,41.55 IC2.25 | 22.76,42.57 v22.55,42.77 | PROG.6 34.85,30.07 33.83,29.06 33.83,28.25 32.82,27.23 32.82,25.7 IC1.18 32.72,25.6 32.72,24.89 32.21,24.38 v30.89,24.38 | v22.76,40.03 22.45,40.34 22.45,41.35 IC2.18 | SEL.2 46.02,29.16 46.02,39.83 40.95,44.91 C7.2 40.84,45.01 37.29,48.56 35.05,48.56 C6.1 34.95,48.67 34.65,48.67 33.73,49.58 19.61,49.58 18.34,48.31
  Bottom 0.203: 25.09,34.24 IC2.7 24.99,34.14 24.99,33.43 24.28,32.72 24.28,31.7 C1.1 23.37,31.6 20.73,28.96 17.58,28.96 16.97,28.35 16.97,26.01 C11.- | 31.75,33.27 34.95,36.47 34.95,36.98 C2.2 | 31.75,33.27 31.09,32.61 31.09,31.7 C3.1 | 15.75,36.98 15.75,32.82 14.33,31.39 LD1086DT50.1 14.22,31.29 13.82,30.89 13.82,26.21 14.12,25.91 16.87,25.91 C11.- | 15.75,36.98 15.75,38.61 | 15.75,38.61 15.75,40.13 16.87,41.25 16.87,43.59 C4.1 16.97,43.69 18.39,45.11 18.39,48.26 18.34,48.31 | 18.34,48.31 17.68,48.97 4.98,48.97 0.81,44.81 0.81,43.18 3.96,40.03 3.96,36.98 POWER.1 | 31.75,33.27 30.07,34.95 30.07,36.47 29.57,36.98 15.75,36.98 | 15.75,38.61 v15.95,38.61 | v16.87,24.49 16.87,25.81 C11.-
N$1  (via drill 0.3)
  Top 0.203: v21.44,32.92 21.44,33.22 v23.77,35.56
  Bottom 0.203: v21.44,32.92 21.44,31.7 C10.2 | v23.77,35.56 24.59,35.56 24.79,35.36 27.94,35.36 28.25,35.05 28.25,34.24 IC2.2
N$2
  Bottom 0.203: PWR.C 6.81,38.1 6.81,40.03 9.25,42.47 11.07,42.47 14.94,46.33 R2.1
N$3  (via drill 0.3)
  Top 0.203: v28.55,20.62 29.36,20.62 33.43,16.56 v33.43,11.48
  Bottom 0.203: CC1.2 38,9.04 35.87,9.04 34.95,9.96 CRISTAL.B 34.85,10.06 v33.43,11.48 | v28.55,20.62 26.21,20.62 IC1.7
N$4
  Top 0.203: A4988.SLEEP 22.35,8.53 22.35,10.97 A4988.RESET
N$6
  Bottom 0.203: R1.2 26.01,3.96 27.23,3.96 28.96,2.23 33.12,2.23 OK1.1
N$7
  Bottom 0.203: TRIG.3 46.02,10.67 45.41,10.67 41.05,6.3 41.05,3.35 39.93,2.23 39.32,2.23 OK1.8
N$9
  Bottom 0.203: TRIG.2 46.02,11.68 45.41,11.68 40.64,6.91 40.64,5.49 39.93,4.78 39.32,4.78 OK1.6
N$10
  Bottom 0.203: TRIG.1 46.13,9.86 46.63,9.86 47.14,10.36 47.14,12.19 46.94,12.39 45.11,12.39 39.32,6.6 39.32,5.99 OK1.5 39.22,5.89 38.71,5.89 37.9,5.08 37.9,4.27 38.71,3.45 39.22,3.45 OK1.7
N$11
  Bottom 0.203: MOTOR.1 4.06,12.9 4.06,13.31 6.81,16.05 9.55,16.05 A4988.2B
N$13  (via drill 0.3)
  Top 0.203: v24.89,21.03 24.89,11.28 v26.82,9.35
  Bottom 0.203: CRISTAL.A 31.09,9.96 30.18,9.04 28.04,9.04 CC2.2 27.94,9.04 27.64,9.35 v26.82,9.35 | v24.89,21.03 25.3,21.44 26.11,21.44 IC1.8
N$14
  Bottom 0.203: R4.2 29.06,4.06 32,4.06 32.61,4.67 33.12,4.67 OK1.3
N$16
  Bottom 0.203: MOTOR.2 4.06,11.99 5.28,11.99 6.81,13.51 9.55,13.51 A4988.2A
N$18
  Bottom 0.203: MOTOR.3 4.06,10.97 9.55,10.97 A4988.1A
N$23
  Bottom 0.203: MOTOR.4 4.06,9.86 8.23,9.86 9.55,8.53 A4988.1B
N$28
  Top 0.203: IC7.5 15.54,41.66 14.73,41.66 11.07,45.31 10.46,45.31 IC7.1
PA5  (via drill 0.3)
  Top 0.203: v2.13,29.46 2.13,22.05 v3.45,20.73 3.45,10.77 9.25,4.98 9.55,4.98 12.09,2.44 27.03,2.44 35.76,11.18 v35.76,15.34
  Bottom 0.203: v2.13,29.46 2.13,31.7 R13.1 | v3.45,20.73 3.45,20.42 3.96,19.91 ENCSEL.1 | v35.76,15.34 37.08,16.66 37.69,16.66 IC1.32
PA6  (via drill 0.3)
  Top 0.203: v42.98,18.39 43.48,18.39 44.3,19.2 44.3,36.98 v41.96,39.32 | v27.03,30.38 31.5,34.85 33.63,34.85 v33.93,34.54
  Bottom 0.203: v42.98,18.39 42.06,17.48 37.8,17.48 IC1.31 | 40.59,40.69 38.91,42.37 R17.1 | 40.59,40.69 v41.96,39.32 | v27.03,30.38 27.13,30.28 27.13,27.53 25.91,26.31 25.91,25.5 22.35,21.95 22.35,21.23 A4988.EN | v33.93,34.54 34.44,34.54 40.59,40.69
PA7  (via drill 0.3)
  Top 0.203: v34.65,15.85 34.65,10.67 27.43,3.45 22.35,3.45 A4988.DIR
  Bottom 0.203: v34.65,15.85 36.98,18.19 37.69,18.19 IC1.30
PB2
  Bottom 0.203: IC1.42 29.46,14.02 29.46,10.77 28.65,9.96 26.31,9.96 22.35,5.99 A4988.STEP
PB5  (via drill 0.3)
  Top 0.203: v24.28,15.14 24.28,9.65 27.13,6.81 27.74,6.81 31.19,10.26 v31.19,17.88
  Bottom 0.203: v24.28,15.14 24.99,15.85 26.11,15.85 IC1.1 | v31.19,17.88 31.19,19.41 37.19,25.4 37.19,29.77 36.88,30.07 PROG.4
PB6  (via drill 0.3)
  Top 0.203: v23.57,18.59 23.57,18.9 22.76,19.71 21.95,19.71 21.34,19.1 21.34,8.13 22.45,7.01 26.31,7.01 26.92,6.4 27.94,6.4 31.8,10.26 v31.8,17.27 | v39.83,27.13 v36.07,23.37
  Bottom 0.203: v23.57,18.59 25.4,16.76 26.11,16.76 IC1.2 | v31.8,17.27 31.8,19.1 v36.07,23.37 | v39.83,27.13 39.83,30.07 PROG.1
PB7  (via drill 0.3)
  Top 0.203: v27.43,17.98 27.43,18.19 25.5,20.12 25.5,22.66 v23.37,24.79 | v23.06,29.06 23.06,33.93 v25.09,35.97 | v29.06,35.97 33.43,35.97 v37.8,31.6
  Bottom 0.203: v27.43,17.98 26.92,17.48 26.21,17.48 IC1.3 | v23.37,24.79 23.37,27.43 23.06,27.74 v23.06,29.06 | v29.06,35.97 v25.09,35.97 | v37.8,31.6 37.8,30.18 PROG.3
PC0  (via drill 0.3)
  Top 0.203: v27.43,7.42 27.43,10.36 25.4,12.39 25.4,15.04 28.14,17.78 28.14,20.12 27.94,20.32 27.94,20.93 30.38,23.37 v31.9,23.37
  Bottom 0.203: v27.43,7.42 26.01,5.99 R1.1 | v31.9,23.37 33.53,24.99 33.53,25.6 IC1.19
PC1  (via drill 0.3)
  Top 0.203: v31.29,8.23 31.29,8.43 34.04,11.18 v34.04,24.38
  Bottom 0.203: v31.29,8.23 29.06,5.99 R4.1 | v34.04,24.38 34.04,24.69 34.34,24.99 34.34,25.6 IC1.20
PC2  (via drill 0.3)
  Top 0.203: v40.74,27.74 v36.58,27.74
  Bottom 0.203: v36.58,27.74 35.26,26.42 35.26,25.7 IC1.21 | v40.74,27.74 42.16,27.74 42.77,28.35 45.82,28.35 46.02,28.14 SEL.1 46.13,28.04 47.14,27.03 47.14,19.41 47.85,18.69 47.85,15.44 R6.1
PC3
  Bottom 0.203: IC1.22 35.87,25.6 35.87,24.69 30.79,19.61 30.79,18.39 24.99,12.6 17.17,12.6 9.55,20.22 9.25,20.22 7.82,21.64 7.82,26.21 6.81,27.23 U$3.SDIN/D1
PC4  (via drill 0.3)
  Top 0.203: v39.12,24.08 39.12,22.05 40.95,20.22 40.95,15.75 27.23,2.03 9.65,2.03 1.52,10.16 1.52,29.77 1.83,30.07 6.5,30.07 6.71,29.87 U$3.SCLK/D0
  Bottom 0.203: v39.12,24.08 38.91,23.88 37.8,23.88 IC1.23
PC5
  Bottom 0.203: IC1.24 37.8,23.16 39.12,23.16 43.18,27.23 U$3.RS/DC
PC6  (via drill 0.3)
  Top 0.203: v41.96,24.38 41.96,18.39 43.18,17.17 U$3.RES
  Bottom 0.203: v41.96,24.38 39.93,22.35 37.8,22.35 IC1.25
PC7
  Bottom 0.203: IC1.26 37.8,21.54 40.03,21.54 43.18,24.69 U$3.CS
PD0  (via drill 0.3)
  Top 0.203: v23.67,22.35 23.27,22.35 19.71,25.91 15.04,25.91 v14.43,26.52
  Bottom 0.203: v23.67,22.35 26.11,22.35 IC1.9 | v14.43,26.52 14.43,28.65 19.91,34.14 19.91,35.05 21.44,36.58 29.36,36.58 29.67,36.27 29.67,34.95 28.96,34.24 IC2.1
PD1
  Bottom 0.203: IC1.10 26.21,23.16 26.92,23.16 27.23,23.47 27.23,24.59 26.31,25.5 26.31,26.11 27.64,27.43 27.64,32.11 26.42,33.33 26.42,34.14 IC2.5
PD2  (via drill 0.3)
  Top 0.203: v26.11,24.69 24.38,24.69 23.67,25.4 20.83,25.4 v19.71,26.52 | v5.38,28.35 v17.88,28.35
  Bottom 0.203: v26.11,24.69 26.11,23.88 IC1.11 | v17.88,28.35 v19.71,26.52 | v5.38,28.35 4.06,27.03 ENC.1
PD3  (via drill 0.3)
  Top 0.203: v26.92,25.81 21.34,25.81 20.02,27.13 8.13,27.13 v7.01,26.01
  Bottom 0.203: v26.92,25.81 27.03,25.7 27.94,25.7 IC1.12 | v7.01,26.01 4.06,26.01 ENC.3
PD4  (via drill 0.3)
  Top 0.203: v28.75,27.03 28.75,27.43 v26.52,29.67
  Bottom 0.203: v28.75,27.03 28.75,25.7 IC1.13 | v26.52,29.67 22.76,29.67 22.35,29.26 22.35,23.57 20.73,21.95 20.73,17.68 22.25,16.15 A4988.MS2
PD5  (via drill 0.3)
  Top 0.203: v29.46,18.59 29.46,16.15 v26.01,12.7 | v23.67,11.99 23.67,12.19 22.35,13.51 A4988.MS3
  Bottom 0.203: v29.46,18.59 29.46,25.6 IC1.14 | v26.01,12.7 25.7,12.7 24.99,11.99 v23.67,11.99
PD6  (via drill 0.3)
  Top 0.203: v23.67,14.53 23.67,17.27 22.35,18.59 A4988.MS1
  Bottom 0.203: v23.67,14.53 26.31,14.53 30.28,18.49 30.28,25.6 IC1.15
PD7  (via drill 0.3)
  Top 0.203: 29.67,28.96 29.67,32.11 v31.8,34.24 | 29.67,28.96 v29.67,26.92 | v40.34,19.91 38.61,19.91 35.05,23.47 35.05,28.65 34.75,28.96 29.67,28.96
  Bottom 0.203: v29.67,26.92 29.77,26.82 30.68,26.82 31.09,26.42 31.09,25.7 IC1.16 | v31.8,34.24 31.8,37.59 33.12,38.91 33.83,38.91 34.85,39.93 R3.1 | v40.34,19.91 41.15,20.73 43.28,20.73 43.79,21.23 46.02,21.23 DIR.1
RESET  (via drill 0.3)
  Top 0.203: v20.93,30.07 21.13,30.07 23.47,27.74 25.91,27.74 27.53,26.11 27.53,23.77 | v27.53,19 27.53,23.77 | 32.31,28.14 32.31,24.79 31.29,23.77 27.53,23.77 | 32.31,28.14 v34.44,28.14 | 32.31,28.14 v32.31,28.25
  Bottom 0.203: v20.93,30.07 19.41,31.6 C10.1 | v27.53,19 26.82,18.29 26.21,18.29 IC1.4 | v32.31,28.25 31.19,28.25 R7.1 | v34.44,28.14 35.87,29.57 35.87,30.07 PROG.5
USBVCC  (via drill 0.3)
  Top 0.203: v28.65,45.11 26.62,43.08 X2.VBUS | v32.82,30.58 37.69,30.58 39.93,32.82 39.93,38.2 | 39.93,41.05 39.93,41.35 T1.2 39.93,41.05 | 39.93,41.05 39.93,38.2 | 39.93,38.2 31.8,38.2 31.5,38.51 29.77,38.51 C5.A | 39.93,41.05 v38.81,41.05
  Bottom 0.203: v28.65,45.11 32.11,48.56 32.92,48.56 C6.2 32.92,48.46 32.92,46.43 38.3,41.05 v38.81,41.05 | v32.82,30.58 30.28,30.58 29.26,31.6 29.06,31.6 C3.2
VIN
  Bottom 0.406: 4.88,36.07 4.78,35.97 4.06,35.97 POWER.2 | 4.88,36.07 5.28,36.47 5.28,45.11 8.64,48.46 17.37,48.46 17.88,47.95 17.88,45.52 17.58,45.21 16.46,45.21 14.94,43.69 C4.2 | R5.2 24.18,28.35 24.18,24.59 21.23,21.64 21.23,18.19 22.15,17.27 22.76,17.27 23.47,16.56 23.47,15.65 22.86,15.04 15.75,15.04 9.65,21.13 A4988.VMOT 9.75,21.34 11.07,22.66 11.07,25.81 C11.+ 11.07,26.01 9.75,27.33 9.75,31.29 LD1086DT50.3 9.55,31.39 4.88,36.07

### Text on the board
tPlace: ZenSlider Controller V1.1